# Altium schematic sheet top_sheet.SchDoc
size A4; SheetNumber: 1; SheetTotal: 8
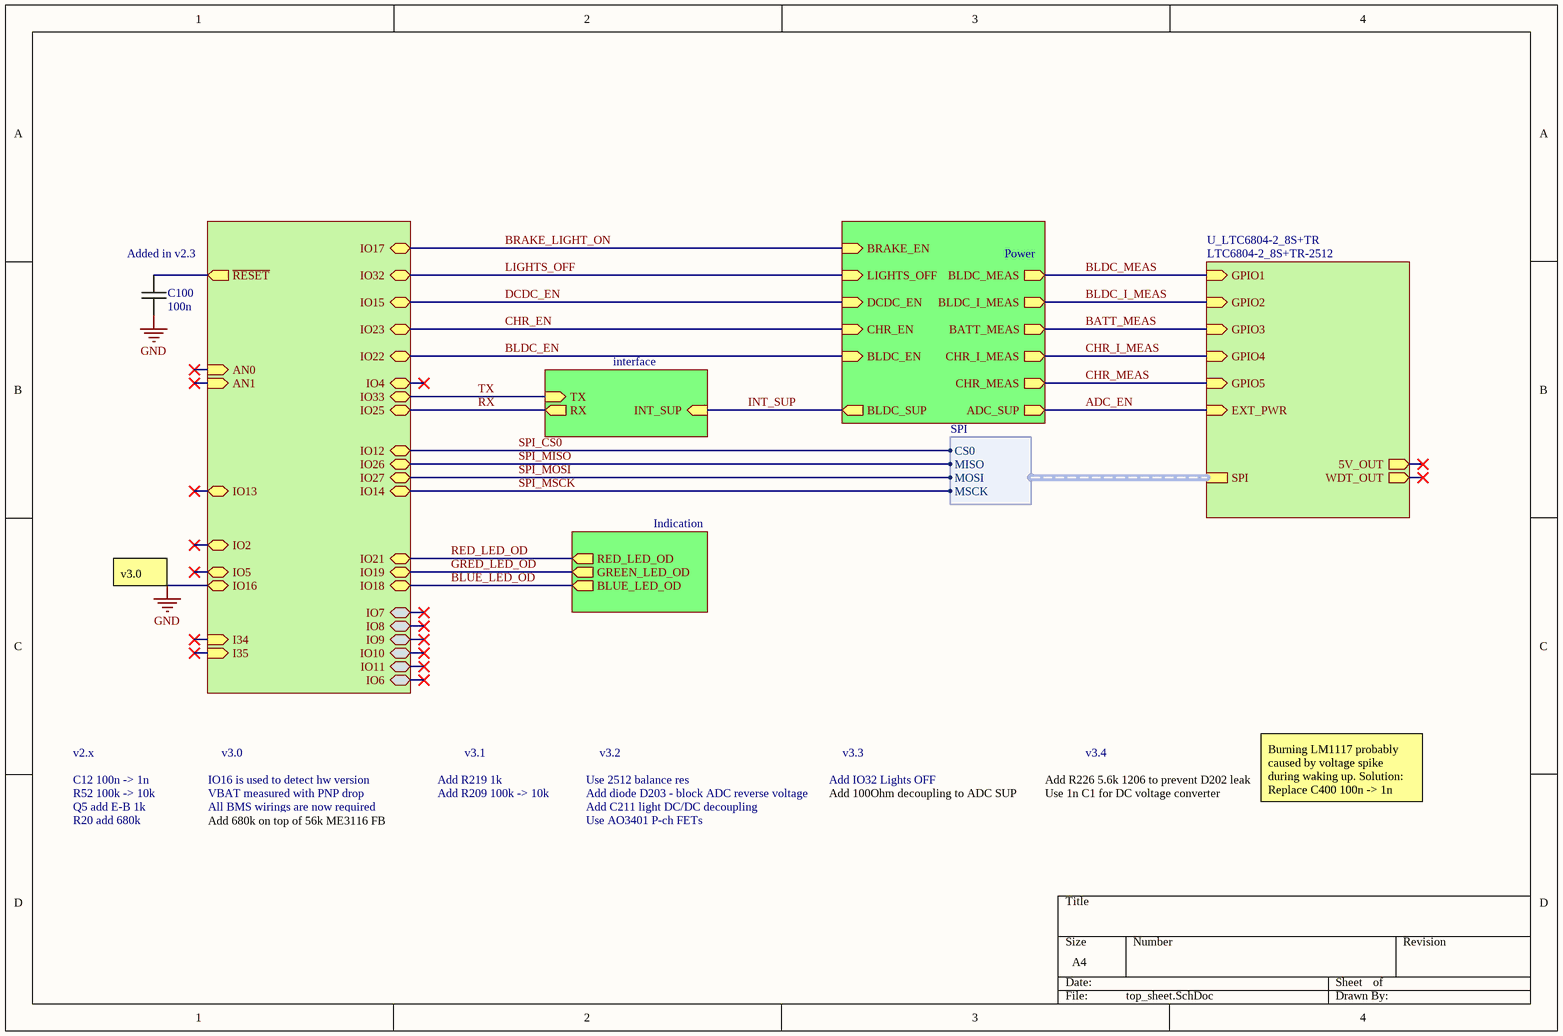
[diagram p0: top_sheet.SchDoc]

## Parts
C100  100n  [CAPC0603(1608)55_N]

## Sub-sheets
Indication = indication.SchDoc: RED_LED_OD (out), GREEN_LED_OD (out), BLUE_LED_OD (out)
interface = data_interface.SchDoc: TX (in), RX (out), INT_SUP (in)
Power = power.SchDoc: BLDC_EN (in), BLDC_I_MEAS (out), CHR_EN (in), CHR_I_MEAS (out), BLDC_MEAS (out), CHR_MEAS (out), BATT_MEAS (out), DCDC_EN (in), BLDC_SUP (out), ADC_SUP (out), LIGHTS_OFF (in), BRAKE_EN (in)
U_ESP32_WROOM2 = ESP32_WROOM2: IO25 (bidir), IO26 (bidir), IO27 (bidir), IO22 (bidir), IO23 (bidir), IO32 (bidir), IO19 (bidir), IO21 (bidir), IO33 (bidir), IO14 (bidir), IO12 (bidir), IO15 (bidir), IO16 (bidir), IO17 (bidir), IO18 (bidir), IO13 (bidir), I34 (in), I35 (in), IO5 (bidir), IO4 (bidir), IO2 (bidir), AN0 (in), AN1 (in), IO7 (bidir), IO8 (bidir), IO9 (bidir), IO10 (bidir), IO11 (bidir), IO6 (bidir), ~{RESET} (out)
U_LTC6804-2_8S+TR = LTC6804-2_8S+TR-2512: GPIO1 (in), GPIO2 (in), GPIO3 (in), GPIO4 (in), GPIO5 (in), SPI (harness SPI), EXT_PWR (in), 5V_OUT (out), WDT_OUT (out)

## Harnesses
SPI: CS0, MISO, MOSI, MSCK

## Nets
GND: C100.2 ; sheet U_ESP32_WROOM2/IO16
ADC_EN: sheet Power/ADC_SUP, sheet U_LTC6804-2_8S+TR/EXT_PWR
BATT_MEAS: sheet Power/BATT_MEAS, sheet U_LTC6804-2_8S+TR/GPIO3
BLDC_EN: sheet U_ESP32_WROOM2/IO22, sheet Power/BLDC_EN
BLDC_I_MEAS: sheet Power/BLDC_I_MEAS, sheet U_LTC6804-2_8S+TR/GPIO2
BLDC_MEAS: sheet Power/BLDC_MEAS, sheet U_LTC6804-2_8S+TR/GPIO1
BLUE_LED_OD: sheet U_ESP32_WROOM2/IO18, sheet Indication/BLUE_LED_OD
BRAKE_LIGHT_ON: sheet U_ESP32_WROOM2/IO17, sheet Power/BRAKE_EN
CHR_EN: sheet U_ESP32_WROOM2/IO23, sheet Power/CHR_EN
CHR_I_MEAS: sheet Power/CHR_I_MEAS, sheet U_LTC6804-2_8S+TR/GPIO4
CHR_MEAS: sheet Power/CHR_MEAS, sheet U_LTC6804-2_8S+TR/GPIO5
DCDC_EN: sheet U_ESP32_WROOM2/IO15, sheet Power/DCDC_EN
GRED_LED_OD: sheet U_ESP32_WROOM2/IO19, sheet Indication/GREEN_LED_OD
INT_SUP: sheet Power/BLDC_SUP, sheet interface/INT_SUP
LIGHTS_OFF: sheet U_ESP32_WROOM2/IO32, sheet Power/LIGHTS_OFF
RED_LED_OD: sheet U_ESP32_WROOM2/IO21, sheet Indication/RED_LED_OD
RX: sheet U_ESP32_WROOM2/IO25, sheet interface/RX
SPI_CS0: sheet U_ESP32_WROOM2/IO12, sheet U_LTC6804-2_8S+TR/SPI.CS0
SPI_MISO: sheet U_ESP32_WROOM2/IO26, sheet U_LTC6804-2_8S+TR/SPI.MISO
SPI_MOSI: sheet U_ESP32_WROOM2/IO27, sheet U_LTC6804-2_8S+TR/SPI.MOSI
SPI_MSCK: sheet U_ESP32_WROOM2/IO14, sheet U_LTC6804-2_8S+TR/SPI.MSCK
TX: sheet U_ESP32_WROOM2/IO33, sheet interface/TX
NetC100_1: C100.1 ; sheet U_ESP32_WROOM2/~{RESET}

## Notes on the sheet
- (near C100) Added in v2.3
- v3.0
- v2.x
- C12 100n -> 1n
- IO16 is used to detect hw version
- Add R219 1k
- v3.1
- Use 2512 balance res
- v3.2
- Add IO32 Lights OFF
- v3.3
- Add R226 5.6k 1206 to prevent D202 leak
- v3.4
- R52 100k -> 10k
- Q5 add E-B 1k
- R20 add 680k
- VBAT measured with PNP drop
- All BMS wirings are now required
- Add 680k on top of 56k ME3116 FB
- Add R209 100k -> 10k
- Add diode D203 - block ADC reverse voltage
- Add C211 light DC/DC decoupling
- Use AO3401 P-ch FETs
- Add 100Ohm decoupling to ADC SUP
- Use 1n C1 for DC voltage converter
- Burning LM1117 probably caused by voltage spike during waking up. Solution: Replace C400 100n -> 1n

## Library data of the parts
C100 = Capacitor M: Ceramic capacitor Medium density; Value: 100n